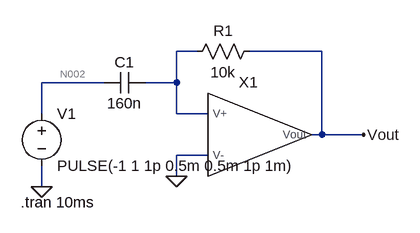
[diagram p0: schematic DifferentiatorAmplifier.asc]
DifferentiatorAmplifier.asc, the LTspice schematic file:
Version 4
SHEET 1 880 680
WIRE 240 32 208 32
WIRE 432 32 320 32
WIRE 96 80 0 80
WIRE 208 80 208 32
WIRE 208 80 160 80
WIRE 0 128 0 80
WIRE 208 128 208 80
WIRE 256 128 208 128
WIRE 432 160 432 32
WIRE 432 160 416 160
WIRE 496 160 432 160
WIRE 256 192 208 192
WIRE 208 224 208 192
WIRE 0 240 0 208
FLAG 0 240 0
FLAG 208 224 0
FLAG 496 160 Vout
SYMBOL voltage 0 112 R0
WINDOW 123 0 0 Left 0
WINDOW 39 0 0 Left 0
SYMATTR InstName V1
SYMATTR Value PULSE(-1 1 1p 0.5m 0.5m 1p 1m)
SYMBOL res 336 16 R90
WINDOW 0 0 56 VBottom 2
WINDOW 3 32 56 VTop 2
SYMATTR InstName R1
SYMATTR Value 10k
SYMBOL cap 160 64 R90
WINDOW 0 0 32 VBottom 2
WINDOW 3 32 32 VTop 2
SYMATTR InstName C1
SYMATTR Value 160n
SYMBOL MY_IDEAL_opamp 320 160 R0
SYMATTR InstName X1
TEXT -32 264 Left 2 !.tran 10ms

The netlist it stands for:
* DifferentiatorAmplifier.asc
V1 N002 0 PULSE(-1 1 1p 0.5m 0.5m 1p 1m)
R1 Vout N001 10k
C1 N001 N002 160n
XX1 N001 0 Vout MY_IDEAL_opamp  ; pins V+ V- Vout
.tran 10ms
.backanno
.end

* Results of the author's LTspice run, read from the files saved beside the schematic
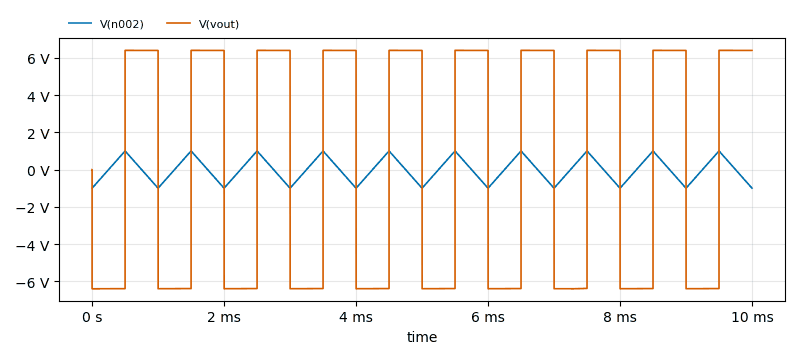
[diagram p1: Transient Analysis of DifferentiatorAmplifier.asc, plotted from the saved traces]
* Transient Analysis, 1 run:
*   V(n002): min -1 V, max 1 V, average 0 V, rms 984.7 mV, last -1 V
*   V(vout): min -6.404 V, max 6.403 V, average 6.8 mV, rms 6.397 V, last 6.4 V